# EAGLE design PowerCastel (EAGLE 9.2.2)
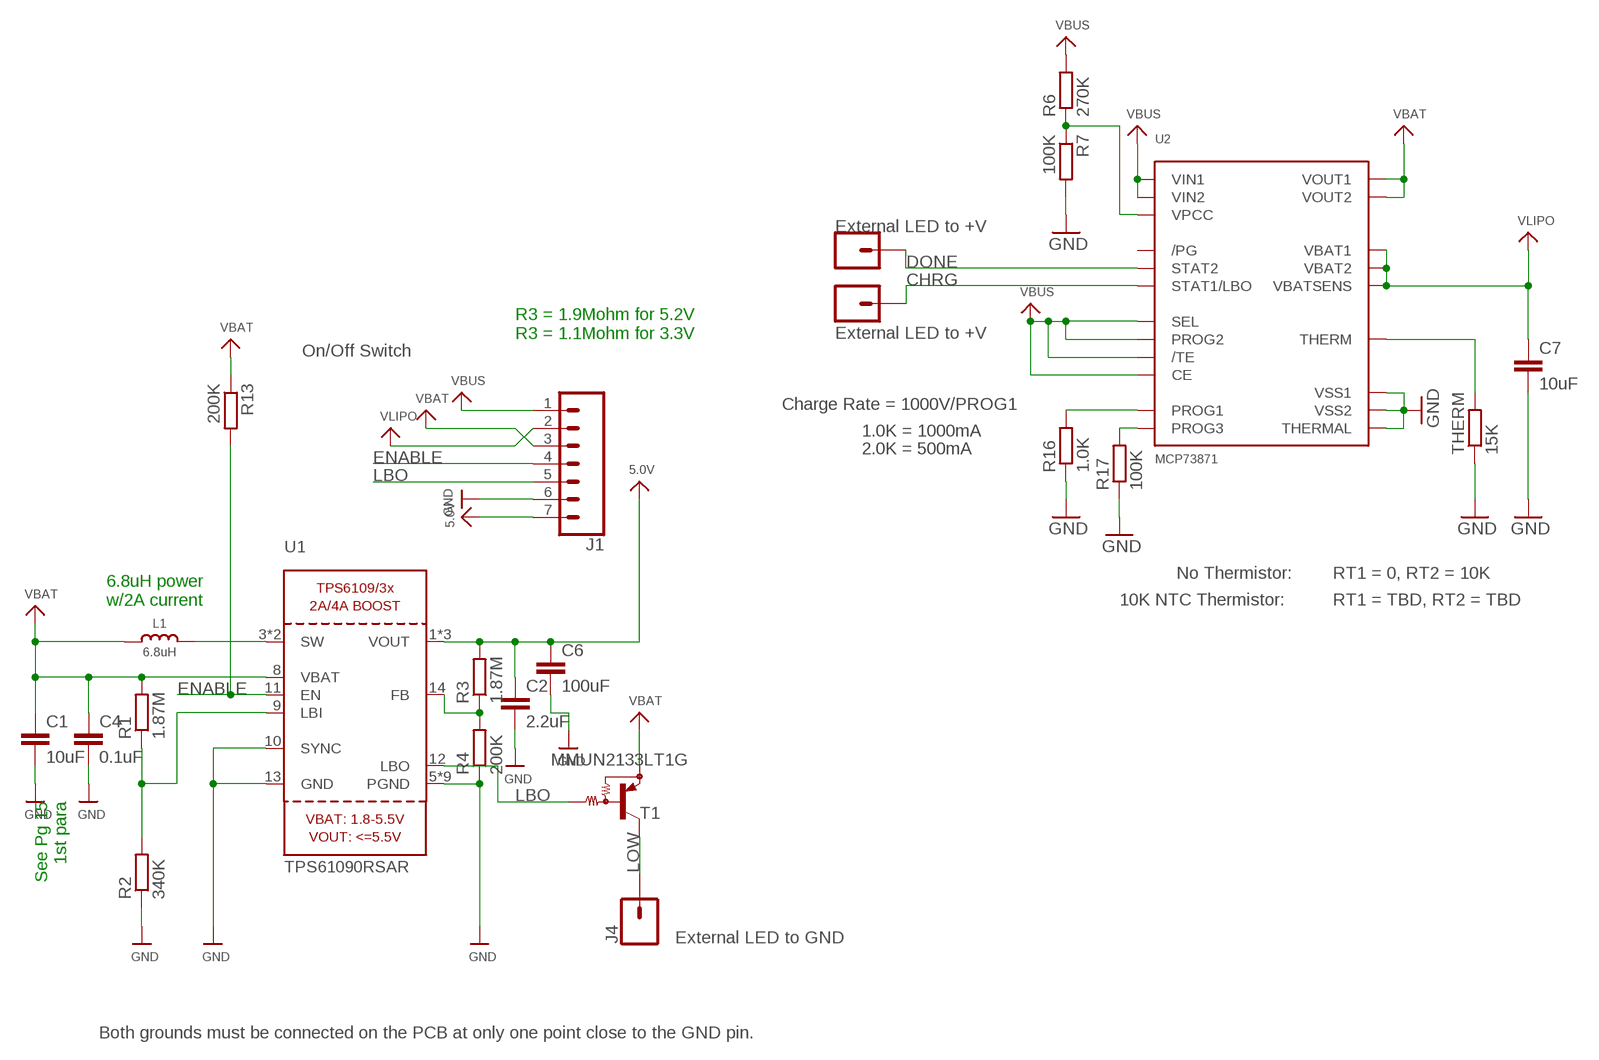
[diagram p0: schematic, sheet 1]

## Parts
C1  10uF  C-EUC0603  [C0603]
C2  2.2uF  C-EUC0603  [C0603]
C4  0.1uF  C-EUC0603  [C0603]
C6  100uF  C-EUC0805  [C0805]
C7  10uF  C-EUC0603  [C0603]
J1  CONN_07NO_SILK  [1X07_NO_SILK]
J2  CONN_01PTH_NO_SILK_YES_STOP  [1X01_NO_SILK]
J3  CONN_01PTH_NO_SILK_YES_STOP  [1X01_NO_SILK]
J4  CONN_01PTH_NO_SILK_YES_STOP  [1X01_NO_SILK]
L1  6.8uH  INDUCTORTDK_VLC5045  [INDUCTOR_5X5MM_TDK_VLC5045]
R1  1.87M  R-EU_R0603  [R0603]
R2  340K  R-EU_R0603  [R0603]
R3  1.87M  R-EU_R0603  [R0603]
R4  200K  R-EU_R0603  [R0603]
R6  270K  R-EU_R0603  [R0603]
R7  100K  R-EU_R0603  [R0603]
R13  200K  R-EU_R0603  [R0603]
R16  1.0K  R-EU_R0603  [R0603]
R17  100K  R-EU_R0603  [R0603]
T1  MMUN2133LT1G  MUN2114T1-PNP_DRIVER-SC59-BEC  [SC59-BEC]
THERM  15K  R-EU_R0603  [R0603]
U1  TPS61090RSAR  VREG_TPS6103X  [PVQFN-16]
U2  MCP73871  [QFN20_4MM]

## Nets
5.0V: C2.1 C6.1 J1.7 R3.2 U1.1(VOUT) U1.15(VOUT) U1.16(VOUT)
CHRG: J3.1 U2.P$8(STAT1/LBO)
DONE: J2.1 U2.P$7(STAT2)
ENABLE: J1.4 R13.2 U1.11(EN)
GND: C1.2 C2.2 C4.2 C6.2 C7.2 J1.6 R2.1 R4.1 R7.2 R16.1 R17.1 THERM.1 U1.5(PGND) U1.6(PGND) U1.7(PGND) U1.10(SYNC) U1.13(GND) U1.P$18(PGND) U1.P$19(PGND) U1.P$20(PGND) U1.P$21(PGND) U1.P$22(PGND) U1.THERMAL(PGND) U2.P$10(VSS1) U2.P$11(VSS2) U2.P$21(THERMAL)
LBO: J1.5 T1.B U1.12(LBO)
LOW: J4.1 T1.C
N$1: L1.P$2 U1.3(SW) U1.4(SW)
N$3: R1.1 R2.2 U1.9(LBI)
N$5: R3.1 R4.2 U1.14(FB)
N$7: R6.1 R7.1 U2.P$2(VPCC)
N$10: THERM.2 U2.P$5(THERM)
N$13: R17.2 U2.P$12(PROG3)
N$16: R16.2 U2.P$13(PROG1)
VBAT: C1.1 C4.1 J1.3 L1.P$1 R1.2 R13.1 T1.E U1.8(VBAT) U2.P$1(VOUT1) U2.P$20(VOUT2)
VBUS: J1.1 R6.2 U2.P$3(SEL) U2.P$4(PROG2) U2.P$9(/TE) U2.P$17(CE) U2.P$18(VIN1) U2.P$19(VIN2)
VLIPO: C7.1 J1.2 U2.P$14(VBAT1) U2.P$15(VBAT2) U2.P$16(VBATSENS)
Unconnected: U2.P$6(/PG)

## Notes on the sheet
- External LED to +V
- R3 = 1.9Mohm for 5.2V
  R3 = 1.1Mohm for 3.3V
- External LED to +V
- On/Off Switch
- Charge Rate = 1000V/PROG1
- 1.0K = 1000mA
- 2.0K = 500mA
- No Thermistor: | RT1 = 0, RT2 = 10K
- 6.8uH power
  w/2A current
- 10K NTC Thermistor: | RT1 = TBD, RT2 = TBD
- See Pg 15
  1st para
- External LED to GND
- Both grounds must be connected on the PCB at only one point close to the GND pin.

## Library data of the parts
C1 C2 C4 C6 C7 = rcl:C-EU: CAPACITOR, European symbol; SPICEPREFIX: C
J1 = SparkFun-Connectors:CONN_07: Multi connection point. Often used as Generic Header-pin footprint for 0.1 inch spaced/style header connections On any of the 0.1 inch spaced packages, you can populate with these: Break Away Headers - Straight <https://www.sparkfun.com/products/116> (PRT-00116) Break Away Male Headers - Right Angle <https://www.sparkfun.com/products/553> (PRT-00553) Female Headers <https://www.sparkfun.com/products/115> (PRT-00115) Break Away Headers - Machine Pin <https://www.sparkfun.com/products/117> (PRT-00117) Break Away Female Headers - Swiss Machine Pin <https://www.sparkfun.com/products/743> (PRT-00743) For SCREWTERMINALS and SPRING TERMINALS visit here: Screw Terimnals on SparkFun.com <https://www.sparkfun.com/search/results?term=Screw+Terminals> (5mm/3.5mm/2.54mm spacing) This device is also useful as a general connection point to wire up your design to another part of your project. Our various solder wires solder well into these plated through hole pads. Hook-Up Wire - Assortment (Stranded, 22 AWG) <https://www.sparkfun.com/products/11375> (PRT-11375) Hook-Up Wire - Assortment (Solid Core, 22 AWG) <https://www.sparkfun.com/products/11367> (PRT-11367) View the entire wire category on our website here <https://www.sparkfun.com/categories/141> Special notes: Molex polarized connector foot print use with SKU : PRT-08231 with associated crimp pins and housings. 1MM SMD Version SKU: PRT-10208 NOTES ON THE VARIANTS LOCK and LOCK_LONGPADS... This footprint was designed to help hold the alignment of a through-hole component (i.e. 6-pin header) while soldering it into place. You may notice that each hole has been shifted either up or down by 0.005 of an inch from it's more standard position (which is a perfectly straight line). This slight alteration caused the pins (the squares in the middle) to touch the edges of the holes. Because they are alternating, it causes a "brace" to hold the component in place. 0.005 has proven to be the perfect amount of "off-center" position when using our standard breakaway headers. Although looks a little odd when you look at the bare footprint, once you have a header in there, the alteration is very hard to notice. Also,if you push a header all the way into place, it is covered up entirely on the bottom side.
J2-J4 = SparkFun-Connectors:CONN_01: Single connection point. Often used as Generic Header-pin footprint for 0.1 inch spaced/style header connections On any of the 0.1 inch spaced packages, you can populate with these: Break Away Headers - Straight <https://www.sparkfun.com/products/116> (PRT-00116) Break Away Male Headers - Right Angle <https://www.sparkfun.com/products/553> (PRT-00553) Female Headers <https://www.sparkfun.com/products/115> (PRT-00115) Break Away Headers - Machine Pin <https://www.sparkfun.com/products/117> (PRT-00117) Break Away Female Headers - Swiss Machine Pin <https://www.sparkfun.com/products/743> (PRT-00743) This device is also useful as a general connection point to wire up your design to another part of your project. Our various solder wires solder well into these plated through hole pads. Hook-Up Wire - Assortment (Stranded, 22 AWG) <https://www.sparkfun.com/products/11375> (PRT-11375) Hook-Up Wire - Assortment (Solid Core, 22 AWG) <https://www.sparkfun.com/products/11367> (PRT-11367) View the entire wire category on our website here <https://www.sparkfun.com/categories/141> Special notes: SMTSO-256-ET is a "flush mount" nut for a 4-40 screw. We mostly use this on specialty testbeds; it is a nice way to connect hardware to your PCB at an adjustable hieght. Also note, the SNAP packages are for using a snappable style connector. We sell a baggie of snaps and they are also used on two LilyPad designs: Snap Assortment - 30 pack (male and female) <https://www.sparkfun.com/products/11347> (DEV-11347) LilyPad Arduino SimpleSnap <https://www.sparkfun.com/products/10941> (DEV-10941) LilyPad SimpleSnap Protoboard <https://www.sparkfun.com/products/10940> (DEV-10940)
L1 = microbuilder:INDUCTOR: Inductors 0603: 10nH Ceramic Inductor - microwire antenna/RF (Digikey: 712-1434-2-ND) 0805: 560nH Ceramic Inductor - RF (Digikey: 553-1047-1-ND) 270nH Ceramic Inductor - Q = 40@250MHz, +-5%, 1 Ohm DC Resistance (Digikey: 535-10506-2-ND) 1007 (2518 Metric) SMT: 10µH 10% 250mOhm 820mA 1007 Inductor (Digikey: 587-2189-1-ND) 22µH 10% 500mOhm 580mA 1007 Inductor (Digikey: 587-2190-1-ND) 47µH 10% 950mOhm 420mA 1007 Inductor (Digikey: 587-2191-1-ND) 47µH 5% 100mOhm 1A 1008 Inductor (Digikey: 732-1816-1-ND) 5.0x5.0mm (Taiyo Yuden NR5040 Series) 6.8µH 20% 2.3A 64mOhm Inductor (Digikey: 587-2374-2-ND) 5.0x5.0mm (TDK VLC5045 Series) 4.7µH 20% 3.3A 34mOhm Inductor (Digikey: 445-6526-1-ND) 6.8µH 20% 2.7A 46mOhm Inductor (Digikey: 445-6527-1-ND) 6.0x6.0mm (TDK VLC6045 Series) 4.7µH 20% 3.8A 27mOhm Inductor (Digikey: 445-6538-2-ND) 6.8µH 20% 3A 41mOhm Inductor (Digikey: 445-6540-1-ND) 6.2µH 30% 2.2A 45mOhm Inductor (Digikey: SRR5028-6R2YCT-ND) - Not TDK VLC6045 but footprint should match 6.0x6.0mm (TDK SLF6045 Series) 6.8uH 30% 2A 33mOhm Inductor (Digikey: 445-4572-1-ND, Mouser: 810-SLF645T6R8N2R0PF) 6.0x6.0mm (Sumida CDRH5D28 Series) 6.2uH 30% 1.8A 45mOhm Inductor (Digikey: 308-1542-1-ND) Taiyo Yuden NR3015T2R2M - 2.2uH 20% 1.5A (Digikey: 587-1648-2-ND, Mouser: 963-NR3015T2R2M) - Used with TI TPS62172 CoilCraft RFID Transponder Coil - MA5532-AE (For use with AS3935 Lightning Sensor) Vishay IHLP 1.0uH Molded Inductor - 24mOhm DCR, 5A, +/-20%, -55°C-125°C (Digikey: 541-1319-1-ND)
R1-R4 R6 R7 R13 R16 R17 THERM = rcl:R-EU_: RESISTOR, European symbol; SPICEPREFIX: R
T1 = transistor:*-PNP_DRIVER-: PNP Bias Resistor Transistor
U1 = microbuilder:VREG_TPS6103X: TPS6103x 4A Boost - 1.8-5.5V Input, Adjustable Output to 5.5V
U2 = microbuilder:MCP73871: MCP73871 Lithium Polymer Battery Charger Digikey: MCP73871-2CCI/ML-ND

## Board
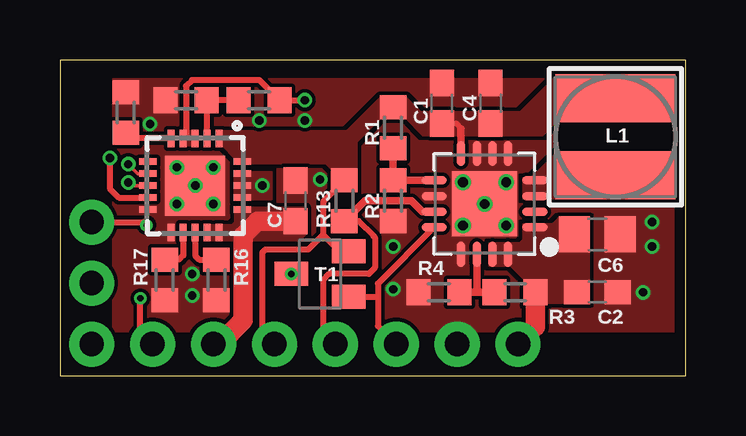
[diagram p1: board, top side]
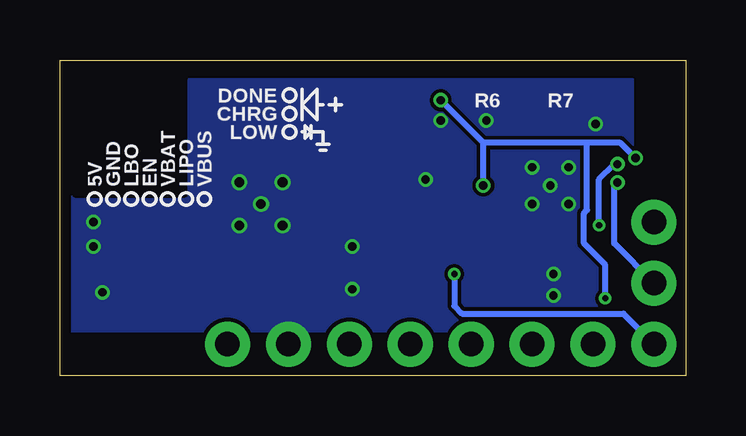
[diagram p2: board, bottom side, seen from below]

Size 26.09 x 13.16 mm. Coordinates in mm from the lower left corner, seen from the top.
Outline: 0,0 26.09,0 26.09,13.16 0,13.16 0,0
Copper layers (1*16): Top 0.035559375mm / dielectric 1.6mm / Bottom 0.035559375mm
Design rules "OshPark": minimum track width 6mil, minimum drill 10mil, track to track 6mil, track to pad 6mil, pad to pad 6mil, via to via 6mil, smd to smd 6mil, copper to edge 15mil, drill to drill 6mil, minimum pad ring 5mil, minimum via ring 5mil, stop-mask expansion 2.5mil, vias tented up to drill 0mil, thermal gap 10mil
tRestrict: area 20.9,9.6 to 25.5,10.3
bRestrict: area 20.9,7.5 to 25.5,12.4

### Footprints (pad centres in the part's own frame; a part is rotated, then mirrored left to right if it is on the bottom)
C0603 = smd 1.1 x 1: 1 -0.85,0; 2 0.85,0
C0805 = smd 1.3 x 1.5: 1 -0.95,0; 2 0.95,0
1X07_NO_SILK = drill 1.016 pad 1.88: 1 0,0; 2 2.54,0; 3 5.08,0; 4 7.62,0; 5 10.16,0; 6 12.7,0; 7 15.24,0
1X01_NO_SILK = drill 1.016 pad 1.88: 1 0,0
INDUCTOR_5X5MM_TDK_VLC5045 = smd 2 x 5: P$1 -1.6,0; P$2 1.6,0
R0603 = smd 1 x 1.1: 1 -0.85,0; 2 0.85,0
SC59-BEC = smd 1 x 1.4: B -0.95,-1.2; C 0,1.2; E 0.95,-1.2
PVQFN-16 = smd 1.05 x 0.35: 1 -2.1,0.975; 2 -2.1,0.325; 3 -2.1,-0.325; 4 -2.1,-0.975; 9 2.1,-0.975; 10 2.1,-0.325; 11 2.1,0.325; 12 2.1,0.975 | smd 0.35 x 1.05: 5 -0.975,-2.1; 6 -0.325,-2.1; 7 0.325,-2.1; 8 0.975,-2.1; 13 0.975,2.1; 14 0.325,2.1; 15 -0.325,2.1; 16 -0.975,2.1 | drill 0.4: P$18 0,0; P$19 -0.9,0.9; P$20 0.9,0.9; P$21 0.9,-0.9; P$22 -0.9,-0.9 | smd 2.7 x 2.7: THERMAL 0,0
QFN20_4MM = smd 0.73 x 0.28: P$1 -1.965,1; P$2 -1.965,0.5; P$3 -1.965,0; P$4 -1.965,-0.5; P$5 -1.965,-1; P$11 1.965,-1; P$12 1.965,-0.5; P$13 1.965,0; P$14 1.965,0.5; P$15 1.965,1 | smd 0.28 x 0.73: P$6 -1,-1.965; P$7 -0.5,-1.965; P$8 0,-1.965; P$9 0.5,-1.965; P$10 1,-1.965; P$16 1,1.965; P$17 0.5,1.965; P$18 0,1.965; P$19 -0.5,1.965; P$20 -1,1.965 | smd 2.5 x 2.5: P$21 0,0

### Placement (x,y rotation side)
C1  15.93,11.35 90 top
C2  22.4,3.48 0 top
C4  17.96,11.35 90 top
C6  22.4,5.89 0 top
C7  9.83,7.29 90 top
J1  3.86,1.32 0 top
J2  1.32,6.4 0 top
J3  1.32,3.86 0 top
J4  1.32,1.32 0 top
L1  23.16,9.96 270 top
R1  13.89,10.34 90 top
R2  13.89,7.29 90 top
R3  18.97,3.48 0 top
R4  15.8,3.48 0 top
R6  8.31,11.48 0 top
R7  5.26,11.48 180 top
R13  11.86,7.29 270 top
R16  6.53,3.99 90 top
R17  4.37,3.99 90 top
T1  10.85,4.24 90 top
THERM  2.74,10.97 270 top
U1  17.7,7.16 180 top
U2  5.64,7.92 270 top

### Tracks (layer width: path | path; a pad name or v marks a point on that pad's centre or on a via)
5.0V
  Top 0.813: J1.7 19.82,2.04 R3.2
  pour Top (no thermals): 19.33,6.32 20.55,6.32 20.83,6.6 22.05,6.6 22.05,3.02 20.35,3.02 20.29,2.97 19.38,2.97 19.38,3.99 18.8,4.57 17.91,4.57 17.91,5.54 19.18,5.54 19.33,5.69
CHRG  (via drill 0.35 pad 0.51)
  Top 0.152: U2.P$8 2.97,7.92 v2.85,8.05
  Bottom 0.254: J3.1 2.97,5.51 2.97,7.92 v2.85,8.05
DONE  (via drill 0.25 pad 0.51, 0.35 pad 0.51)
  Top 0.152: U2.P$7 3.23,8.43 v2.85,8.81
  Top 0.254: J2.1 3.48,6.4 v3.61,6.27
  Bottom 0.254: v2.85,8.81 2.97,8.81 3.61,8.18 v3.61,6.27
ENABLE
  Top 0.254: R13.2 12.46,6.44 13.06,5.83 13.06,5.82 13.13,5.76 13.13,4.49 12.88,4.24 11.23,4.24 10.97,3.99 10.97,1.83 J1.4
  Top 0.305: U1.11 15.11,6.84 14.66,7.29 12.71,7.29 R13.2
GND  (via drill 0.35 pad 0.51)
  other vias: 13.89,5.38 5.64,7.92 4.88,7.16 6.4,7.16 6.4,8.69 4.88,8.69 10.85,8.18 3.76,10.49 8.31,10.64 10.21,10.64 13.89,3.61 24.69,6.4 24.69,5.38 24.31,3.48 5.51,4.24 5.51,3.35
  pour Bottom (rank 2, no thermals): 2.21,1.83 25.58,1.83 25.58,12.37 2.21,12.37
  pour Top (rank 2, no thermals): 2.21,12.37 25.58,12.37 25.58,1.83 2.21,1.83
LBO
  Top 0.254: U1.12 13.26,3.84 13.26,3.35 | J1.5 13.26,2.08 13.26,3.35 | T1.B 13.2,3.29 13.26,3.35
LOW  (via drill 0.25 pad 0.51)
  Bottom 0.254: T1.C 9.65,2.92 9.32,2.59 2.59,2.59 J4.1
  other vias: 9.65,4.24
N$1
  pour Top (no thermals): 19.33,8.26 19.66,8.26 20.7,9.3 25.6,9.3 25.6,7.42 20.73,7.42 20.68,7.37 19.33,7.37
N$3
  Top 0.305: U1.9 R2.2 R1.1
N$5
  Top 0.305: R4.2 17.45,3.48 | 17.45,3.48 R3.1 | U1.14 17.38,3.55 17.45,3.48
N$7
  Top 0.254: U2.P$2 6.14,11.45 R7.1 R6.1
N$10
  Top 0.254: U2.P$5 2.98,9.89 THERM.2
N$13
  Top 0.254: U2.P$12 5.14,5.01 4.96,4.84 R17.2
N$16
  Top 0.254: U2.P$13 5.64,5 5.8,4.84 R16.2
VBAT
  Top 0.254: R13.1 10.97,7.25 10.97,5.88 | 10.97,5.88 11.66,5.19 T1.E | 10.97,5.88 10.35,5.26 8.56,5.26 8.43,5.13 8.43,1.83 J1.3 | C1.1 16.52,10.5 16.73,10.3
  Top 0.305: U1.8 16.73,10.3
  pour Top (no thermals): 6.55,10.21 11.96,10.21 13.39,11.63 14.4,11.63 15.04,11 19.2,11 20.7,12.5 25.6,12.5 25.6,10.62 20.73,10.62 20.12,10.01 15.14,10.01 14.4,10.74 13.39,10.74 12.37,9.73 12.37,7.7 11.35,7.7 11.35,8.59 11.1,8.84 7.29,8.84 7.29,9.07 6.78,9.58 6.55,9.58
VBUS  (via drill 0.25 pad 0.51, 0.35 pad 0.51)
  Top 0.254: U2.P$4 5.26,10.01 5.26,12.08 5.5,12.32 8.32,12.32 R6.2 v10.21,11.48 | v2.08,9.07 2.08,7.8 2.46,7.42 U2.P$9 | J1.1 3.35,1.83 v3.35,3.23
  Bottom 0.254: v8.43,7.92 8.43,9.7 | 8.43,9.7 v10.21,11.48 | v2.08,9.07 2.72,9.7 4.12,9.7 | 4.12,9.7 8.43,9.7 | v3.35,3.23 3.35,4.62 4.24,5.51 4.24,6.78 4.12,6.91 4.12,9.7
  pour Top (no thermals): 7.29,8.51 8.81,8.51 8.81,7.34 7.29,7.34
  pour Top (no thermals): 5.05,10.21 5.74,10.21 5.74,9.58 5.05,9.58
VLIPO
  Top 0.813: J1.2 6.66,1.32 7.64,2.31 7.64,5.84 8.24,6.44 C7.1
  pour Top (no thermals): 7.29,7.01 7.29,6.4 7.16,6.27 6.05,6.27 6.05,5.64 10.01,5.64 10.29,5.92 10.29,6.93 10.21,7.01

### Text on the board
bPlace: DONE | CHRG | LOW | VBUS | LIPO | VBAT | EN | LBO | GND | 5V